# Altium schematic sheet PowerPC_AMCC_PPC405CR_Flash_Recorder.SchDoc
size C; DocumentNumber: 1; SheetNumber: 1; SheetTotal: 1; PageSetup: Record=PageOptions|CenterHorizontal=True|CenterVertical=True|PrintScale=0.75|XCorrection=1.00|YCorrection=1.00|PrintKind=0|BorderSize=5000000|LeftOffset=0|BottomOffset=0|Orientation=2|PaperLength=1000|PaperWidth=1000|Scale=100|PaperSource=7|PrintQuality=-4|MediaType=1|DitherType=10|PaperKind=A4|PrintScaleMode=1
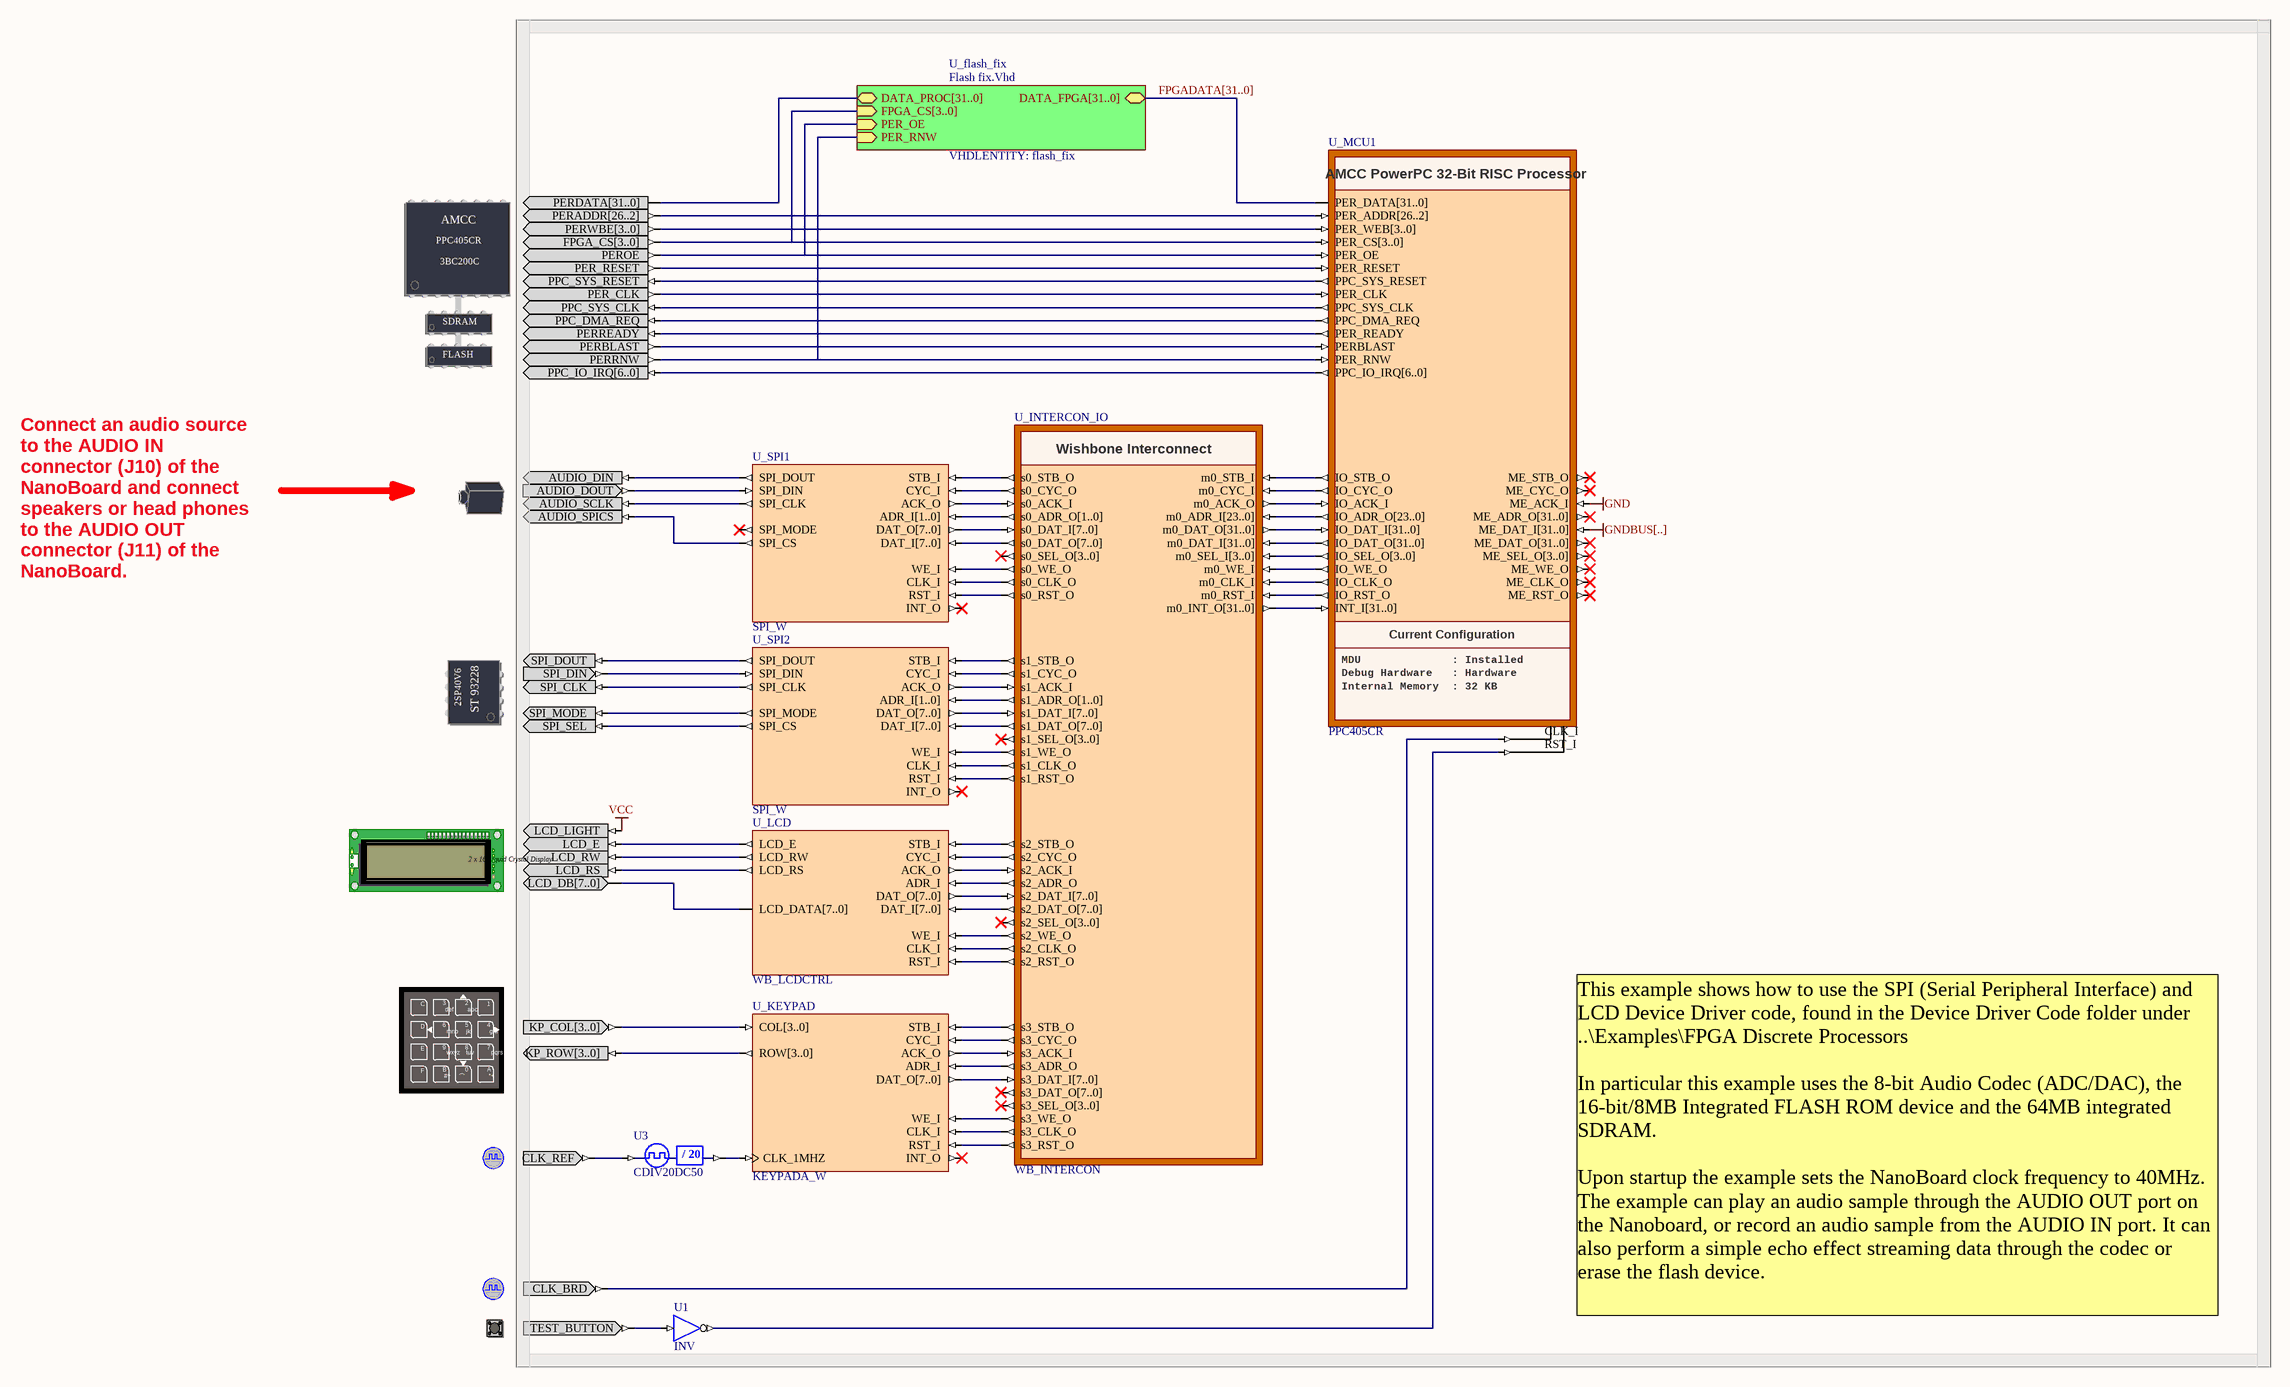
[diagram p0: PowerPC_AMCC_PPC405CR_Flash_Recorder.SchDoc]

## Parts
(Parts that share a designator on the sheet are numbered #1, #2 ... from top to bottom, then left to right.)
?#1  PROCESSOR_PPC405CR  (value not drawn)
?#2  AUDIO_DAC  (value not drawn)
?#3  SERIALFMEMORY  (value not drawn)
?#4  LCD  (value not drawn)
?#5  KEYPAD  (value not drawn)
?#6  CLOCK_REFERENCE  (value not drawn)
?#7  CLOCK_BOARD  (value not drawn)
?#8  TEST_BUTTON  (value not drawn)
U1  INV
U3  CDIV20DC50
U_INTERCON_IO  WB_INTERCON
U_KEYPAD  KEYPADA_W
U_LCD  WB_LCDCTRL
U_MCU1  PPC405CR
U_SPI1  SPI_W
U_SPI2  SPI_W

## Sub-sheets
U_flash_fix = Flash fix.Vhd: DATA_FPGA[31..0] (bidir), DATA_PROC[31..0] (bidir), FPGA_CS[3..0] (in), PER_OE (in), PER_RNW (in)  | VHDLENTITY: flash_fix

## Nets
GND: U_MCU1.ME_ACK_I
GNDBUS[..]: U_MCU1.ME_DAT_I[31..0]
VCC: ?#4.LCD_LIGHT
FPGADATA[31..0]: U_MCU1.PER_DATA[31..0] ; sheet U_flash_fix/DATA_FPGA[31..0]
Net?#1_FPGA_CS[3..0]: ?#1.FPGA_CS[3..0] U_MCU1.PER_CS[3..0] ; sheet U_flash_fix/FPGA_CS[3..0]
Net?#1_PER_CLK: ?#1.PER_CLK U_MCU1.PER_CLK
Net?#1_PER_RESET: ?#1.PER_RESET U_MCU1.PER_RESET
Net?#1_PERADDR[26..2]: ?#1.PERADDR[26..2] U_MCU1.PER_ADDR[26..2]
Net?#1_PERBLAST: ?#1.PERBLAST U_MCU1.PERBLAST
Net?#1_PERDATA[31..0]: ?#1.PERDATA[31..0] ; sheet U_flash_fix/DATA_PROC[31..0]
Net?#1_PEROE: ?#1.PEROE U_MCU1.PER_OE ; sheet U_flash_fix/PER_OE
Net?#1_PERREADY: ?#1.PERREADY U_MCU1.PER_READY
Net?#1_PERRNW: ?#1.PERRNW U_MCU1.PER_RNW ; sheet U_flash_fix/PER_RNW
Net?#1_PERWBE[3..0]: ?#1.PERWBE[3..0] U_MCU1.PER_WEB[3..0]
Net?#1_PPC_DMA_REQ: ?#1.PPC_DMA_REQ U_MCU1.PPC_DMA_REQ
Net?#1_PPC_IO_IRQ[6..0]: ?#1.PPC_IO_IRQ[6..0] U_MCU1.PPC_IO_IRQ[6..0]
Net?#1_PPC_SYS_CLK: ?#1.PPC_SYS_CLK U_MCU1.PPC_SYS_CLK
Net?#1_PPC_SYS_RESET: ?#1.PPC_SYS_RESET U_MCU1.PPC_SYS_RESET
Net?#2_AUDIO_DIN: ?#2.AUDIO_DIN U_SPI1.SPI_DOUT
Net?#2_AUDIO_DOUT: ?#2.AUDIO_DOUT U_SPI1.SPI_DIN
Net?#2_AUDIO_SCLK: ?#2.AUDIO_SCLK U_SPI1.SPI_CLK
Net?#2_AUDIO_SPICS: ?#2.AUDIO_SPICS U_SPI1.SPI_CS
Net?#3_SPI_CLK: ?#3.SPI_CLK U_SPI2.SPI_CLK
Net?#3_SPI_DIN: ?#3.SPI_DIN U_SPI2.SPI_DIN
Net?#3_SPI_DOUT: ?#3.SPI_DOUT U_SPI2.SPI_DOUT
Net?#3_SPI_MODE: ?#3.SPI_MODE U_SPI2.SPI_MODE
Net?#3_SPI_SEL: ?#3.SPI_SEL U_SPI2.SPI_CS
Net?#4_LCD_DB[7..0]: ?#4.LCD_DB[7..0] U_LCD.LCD_DATA[7..0]
Net?#4_LCD_E: ?#4.LCD_E U_LCD.LCD_E
Net?#4_LCD_RS: ?#4.LCD_RS U_LCD.LCD_RS
Net?#4_LCD_RW: ?#4.LCD_RW U_LCD.LCD_RW
Net?#5_KP_COL[3..0]: ?#5.KP_COL[3..0] U_KEYPAD.COL[3..0]
Net?#5_KP_ROW[3..0]: ?#5.KP_ROW[3..0] U_KEYPAD.ROW[3..0]
Net?#6_CLK_REF: ?#6.CLK_REF U3.CLKIN
Net?#7_CLK_BRD: ?#7.CLK_BRD U_MCU1.CLK_I
Net?#8_TEST_BUTTON: ?#8.TEST_BUTTON U1.I
NetU1_O: U1.O U_MCU1.RST_I
NetU3_CLKDV: U3.CLKDV U_KEYPAD.CLK_1MHZ
NetU_INTERCON_IO_m0_ACK_O: U_INTERCON_IO.m0_ACK_O U_MCU1.IO_ACK_I
NetU_INTERCON_IO_m0_ADR_I[23..0]: U_INTERCON_IO.m0_ADR_I[23..0] U_MCU1.IO_ADR_O[23..0]
NetU_INTERCON_IO_m0_CLK_I: U_INTERCON_IO.m0_CLK_I U_MCU1.IO_CLK_O
NetU_INTERCON_IO_m0_CYC_I: U_INTERCON_IO.m0_CYC_I U_MCU1.IO_CYC_O
NetU_INTERCON_IO_m0_DAT_I[31..0]: U_INTERCON_IO.m0_DAT_I[31..0] U_MCU1.IO_DAT_O[31..0]
NetU_INTERCON_IO_m0_DAT_O[31..0]: U_INTERCON_IO.m0_DAT_O[31..0] U_MCU1.IO_DAT_I[31..0]
NetU_INTERCON_IO_m0_INT_O[31..0]: U_INTERCON_IO.m0_INT_O[31..0] U_MCU1.INT_I[31..0]
NetU_INTERCON_IO_m0_RST_I: U_INTERCON_IO.m0_RST_I U_MCU1.IO_RST_O
NetU_INTERCON_IO_m0_SEL_I[3..0]: U_INTERCON_IO.m0_SEL_I[3..0] U_MCU1.IO_SEL_O[3..0]
NetU_INTERCON_IO_m0_STB_I: U_INTERCON_IO.m0_STB_I U_MCU1.IO_STB_O
NetU_INTERCON_IO_m0_WE_I: U_INTERCON_IO.m0_WE_I U_MCU1.IO_WE_O
NetU_INTERCON_IO_s0_ACK_I: U_INTERCON_IO.s0_ACK_I U_SPI1.ACK_O
NetU_INTERCON_IO_s0_ADR_O[1..0]: U_INTERCON_IO.s0_ADR_O[1..0] U_SPI1.ADR_I[1..0]
NetU_INTERCON_IO_s0_CLK_O: U_INTERCON_IO.s0_CLK_O U_SPI1.CLK_I
NetU_INTERCON_IO_s0_CYC_O: U_INTERCON_IO.s0_CYC_O U_SPI1.CYC_I
NetU_INTERCON_IO_s0_DAT_I[7..0]: U_INTERCON_IO.s0_DAT_I[7..0] U_SPI1.DAT_O[7..0]
NetU_INTERCON_IO_s0_DAT_O[7..0]: U_INTERCON_IO.s0_DAT_O[7..0] U_SPI1.DAT_I[7..0]
NetU_INTERCON_IO_s0_RST_O: U_INTERCON_IO.s0_RST_O U_SPI1.RST_I
NetU_INTERCON_IO_s0_STB_O: U_INTERCON_IO.s0_STB_O U_SPI1.STB_I
NetU_INTERCON_IO_s0_WE_O: U_INTERCON_IO.s0_WE_O U_SPI1.WE_I
NetU_INTERCON_IO_s1_ACK_I: U_INTERCON_IO.s1_ACK_I U_SPI2.ACK_O
NetU_INTERCON_IO_s1_ADR_O[1..0]: U_INTERCON_IO.s1_ADR_O[1..0] U_SPI2.ADR_I[1..0]
NetU_INTERCON_IO_s1_CLK_O: U_INTERCON_IO.s1_CLK_O U_SPI2.CLK_I
NetU_INTERCON_IO_s1_CYC_O: U_INTERCON_IO.s1_CYC_O U_SPI2.CYC_I
NetU_INTERCON_IO_s1_DAT_I[7..0]: U_INTERCON_IO.s1_DAT_I[7..0] U_SPI2.DAT_O[7..0]
NetU_INTERCON_IO_s1_DAT_O[7..0]: U_INTERCON_IO.s1_DAT_O[7..0] U_SPI2.DAT_I[7..0]
NetU_INTERCON_IO_s1_RST_O: U_INTERCON_IO.s1_RST_O U_SPI2.RST_I
NetU_INTERCON_IO_s1_STB_O: U_INTERCON_IO.s1_STB_O U_SPI2.STB_I
NetU_INTERCON_IO_s1_WE_O: U_INTERCON_IO.s1_WE_O U_SPI2.WE_I
NetU_INTERCON_IO_s2_ACK_I: U_INTERCON_IO.s2_ACK_I U_LCD.ACK_O
NetU_INTERCON_IO_s2_ADR_O: U_INTERCON_IO.s2_ADR_O U_LCD.ADR_I
NetU_INTERCON_IO_s2_CLK_O: U_INTERCON_IO.s2_CLK_O U_LCD.CLK_I
NetU_INTERCON_IO_s2_CYC_O: U_INTERCON_IO.s2_CYC_O U_LCD.CYC_I
NetU_INTERCON_IO_s2_DAT_I[7..0]: U_INTERCON_IO.s2_DAT_I[7..0] U_LCD.DAT_O[7..0]
NetU_INTERCON_IO_s2_DAT_O[7..0]: U_INTERCON_IO.s2_DAT_O[7..0] U_LCD.DAT_I[7..0]
NetU_INTERCON_IO_s2_RST_O: U_INTERCON_IO.s2_RST_O U_LCD.RST_I
NetU_INTERCON_IO_s2_STB_O: U_INTERCON_IO.s2_STB_O U_LCD.STB_I
NetU_INTERCON_IO_s2_WE_O: U_INTERCON_IO.s2_WE_O U_LCD.WE_I
NetU_INTERCON_IO_s3_ACK_I: U_INTERCON_IO.s3_ACK_I U_KEYPAD.ACK_O
NetU_INTERCON_IO_s3_ADR_O: U_INTERCON_IO.s3_ADR_O U_KEYPAD.ADR_I
NetU_INTERCON_IO_s3_CLK_O: U_INTERCON_IO.s3_CLK_O U_KEYPAD.CLK_I
NetU_INTERCON_IO_s3_CYC_O: U_INTERCON_IO.s3_CYC_O U_KEYPAD.CYC_I
NetU_INTERCON_IO_s3_DAT_I[7..0]: U_INTERCON_IO.s3_DAT_I[7..0] U_KEYPAD.DAT_O[7..0]
NetU_INTERCON_IO_s3_RST_O: U_INTERCON_IO.s3_RST_O U_KEYPAD.RST_I
NetU_INTERCON_IO_s3_STB_O: U_INTERCON_IO.s3_STB_O U_KEYPAD.STB_I
NetU_INTERCON_IO_s3_WE_O: U_INTERCON_IO.s3_WE_O U_KEYPAD.WE_I

Not connected (* = marked no-connect by the designer): U_INTERCON_IO s0_SEL_O[3..0]* s1_SEL_O[3..0]* s2_SEL_O[3..0]* s3_DAT_O[7..0]* s3_SEL_O[3..0]*; U_KEYPAD INT_O*; U_MCU1 ME_ADR_O[31..0]* ME_CLK_O* ME_CYC_O* ME_DAT_O[31..0]* ME_RST_O* ME_SEL_O[3..0]* ME_STB_O* ME_WE_O*; U_SPI1 INT_O* SPI_MODE*; U_SPI2 INT_O*

## Buses and harness runs
bus FPGADATA[31..0] = sheet U_flash_fix/DATA_FPGA[31..0]

## Notes on the sheet
- Connect an audio source to the AUDIO IN connector (J10) of the NanoBoard and connect speakers or head phones to the AUDIO OUT connector (J11) of the NanoBoard.
- This example shows how to use the SPI (Serial Peripheral Interface) and LCD Device Driver code, found in the Device Driver Code folder under ..\Examples\FPGA Discrete Processors
  In particular this example uses the 8-bit Audio Codec (ADC/DAC), the 16-bit/8MB Integrated FLASH ROM device and the 64MB integrated SDRAM.
  Upon startup the example sets the NanoBoard clock frequency to 40MHz. The example can play an audio sample through the AUDIO OUT port on the Nanoboard, or record an audio sample from the AUDIO IN port. It can also perform a simple echo effect streaming data through the codec or erase the flash device.
- Title
- Size:
- Date:
- File:
- C
- Number:
- Time:
- Revision:
- Sheet
- of
- (in symbol CDIV20DC50) / 20
- (in symbol KEYPAD) C; 3; 2; 1; def; abc; 6; 5; 4; D; mno; jkl; ghi; E; 9; 8; 7; wxyz; tuv; pqrs; F; B; 0; A; #^; (; *+
- (in symbol LCD) 2 x 16 Liquid Crystal Display
- (in symbol PPC405CR) AMCC PowerPC 32-Bit RISC Processor; Current Configuration; MDU              : Installed; Debug Hardware   : Hardware; Internal Memory  : 32 KB
- (in symbol PROCESSOR_PPC405CR) AMCC; PPC405CR; 3BC200C; SDRAM; FLASH
- (in symbol SERIALFMEMORY) 2SP40V6; ST 93228
- (in symbol WB_INTERCON) Wishbone Interconnect

## Library data of the parts
?#1 = PROCESSOR_PPC405CR: AMCC PowerPC 405CR Embedded Processor; PortComponent: True; Published: 25-Aug-2005; Publisher: Altium Limited; HelpURL: https://www.amcc.com/MyAMCC/jsp/public/productDetail/product_detail.jsp?productID=PPC405CR
?#2 = AUDIO_DAC: Audio Jack; PortComponent: True; Published: 19-Nov-2003; Publisher: Altium Limited; HelpURL: TR0102 NanoBoard Technical Reference Manual - NB1.pdf#page=38
?#3 = SERIALFMEMORY: Serial Flash Memory; PortComponent: True; Published: 19-Nov-2003; Publisher: Altium Limited; HelpURL: TR0102 NanoBoard Technical Reference Manual - NB1.pdf#page=34
?#4 = LCD: Liquid Crystal Display; PortComponent: True; Published: 19-Nov-2003; Publisher: Altium Limited; HelpURL: TR0102 NanoBoard Technical Reference Manual - NB1.pdf#page=39
?#5 = KEYPAD: Key Pad; PortComponent: True; Published: 19-Nov-2003; Publisher: Altium Limited; HelpURL: TR0102 NanoBoard Technical Reference Manual - NB1.pdf#page=40
?#6 = CLOCK_REFERENCE: Global System Clock Reference Supply; PortComponent: True; Published: 19-Nov-2003; Publisher: Altium Limited; HelpURL: TR0102 NanoBoard Technical Reference Manual - NB1.pdf#page=29
?#7 = CLOCK_BOARD: Global System Clock Supply; PortComponent: True; Published: 19-Nov-2003; Publisher: Altium Limited
?#8 = TEST_BUTTON: Test Button; PortComponent: True; Published: 19-Nov-2003; Publisher: Altium Limited
U1 = INV: Inverter; ArchiveName: GENERIC; FunctionalClass: Logic Primitive; VHDLIB_SIM: GENERIC_LIB; Published: 29-Jan-2004; Publisher: Altium Limited; XilinxEquivalent: INV; LastRevisionNo: 1.00.00; HelpURL: CR0118 FPGA Generic Library Guide.pdf#page=290; ComponentLink1URL: CR0136 FPGA Logic Primitive Resource Usage.pdf#page=61; ComponentLink1Description: Core &Resource Usage; SubClass: INV
U3 = CDIV20DC50: Clock Divider by 20 with 50% Duty Cycle Output; DivisorRate: 20; DutyCycle: 50; ArchiveName: GENERIC; VHDLIB_SIM: GENERIC_LIB; Published: 29-Jan-2004; Publisher: Altium Limited; LastRevisionNo: 1.00.00; HelpURL: CR0118 FPGA Generic Library Guide.pdf#page=142; ComponentLink1URL: CR0127 FPGA Clock Divider Resource Usage.pdf#page=21; ComponentLink1Description: Core &Resource Usage; FunctionalClass: Clock Divider
U_INTERCON_IO = WB_INTERCON: Configurable Wishbone Interconnect; ConfigurationParameters: {}UnusedInterrupts[1]{}MasterAddressBits[1]{}Name0[MAX1104]{}Kind0[0]{}SpaceAfter0[4]{}Address_Base0[0]{}Address_UsedRange0[1]{}Address_Bits0[2]{}Address_Mode0[1]{}Address_DecodeWidth0[4]{}DataWidth0[2]{}UsedInterrupts0[]{}Name1[NanoBoard_SPI]{}Kind1[0]{}SpaceAfter1[4]{}Address_Base1[1048576]{}Address_UsedRange1[1]{}Address_Bits1[2]{}Address_Mode1[0]{}Address_DecodeWidth1[4]{}DataWidth1[2]{}UsedInterrupts1[]{}Name2[LCD]{}Kind2[0]{}SpaceAfter2[4]{}Address_Base2[2097152]{}Address_UsedRange2[1]{}Address_Bits2[1]{}Address_Mode2[1]{}Address_DecodeWidth2[8]{}DataWidth2[2]{}UsedInterrupts2[]{}Name3[Keypad]{}Kind3[0]{}SpaceAfter3[4]{}Address_Base3[3145728]{}Address_UsedRange3[1]{}Address_Bits3[1]{}Address_Mode3[1]{}Address_DecodeWidth3[8]{}DataWidth3[2]{}UsedInterrupts3[]; ComponentLink1Description: Core &Resource Usage; ComponentLink1URL: CR0139 FPGA Peripheral Resource Usage.pdf#page=51; HelpURL: CR0150 WB_INTERCON Configurable Wishbone Interconnect.pdf#page=2; LastRevisionNo: 1.00.00; Published: 9-Dec-2004; Publisher: Altium Limited; ConfiguratorName: WB_INTERCON
U_KEYPAD = KEYPADA_W: Keypad Wishbone; Published: 9-Dec-2004; Publisher: Altium Limited; LastRevisionNo: 1.00.00; HelpURL: CR0106 Keypad Controller.pdf#page=2; ComponentLink1Description: Core &Resource Usage; ComponentLink1URL: CR0139 FPGA Peripheral Resource Usage.pdf#page=15
U_LCD = WB_LCDCTRL: LCD Controller Wishbone; ArchiveName: GENERIC; Published: 9-Dec-2004; Publisher: Altium Limited; ComponentLink1Description: Core &Resource Usage; ComponentLink1URL: CR0139 FPGA Peripheral Resource Usage.pdf#page=56; LastRevisionNo: 1.00.00
U_MCU1 = PPC405CR: AMCC PowerPC PPC405 RISC Processor; ChildModel1: TSK3000A_MCU; Nexus_JTAG_Device: False; Nexus_Core: Processor_Hard; Nexus_JTAG_Order: 0; ChildModel2: TSK3000A_MDU; ChildModel3: TSK3000A_OCDS; ChildModel4: TSK3000A_Shift_Barrel; ChildModel5: TSK3000A_Shift_Sequential; ChildModel6: Mult_32x32; ConfigurationParameters: {}Version[1.0]{}Option_Processor[2]{}Option_Memory[5]{}Option_MDU[0]{}Option_OCDS[2]{}Option_Shifter[0]{}Option_InterruptCount[32]{}Option_DebugWhenReset[0]{}; ChildModel7: m33x33; Memory_Configuration: Record[PERIPHERAL]{}ComponentDesignator[MAX1104]{}Memory_Depth[0x0004]{}Memory_UsageType[ram]{}ProgramDownloadAddress[0xFF000000]{}Memory_BusType[PPC:local_bus]{}Memory_Mau[8]{}Memory_MatchedComponent[]{}Memory_Description[U_INTERCON_IO]{}Memory_FillBitPattern[]{}Memory_Interrupts[]{n}Record[PERIPHERAL]{}ComponentDesignator[NanoBoard_SPI]{}Memory_Depth[0x0004]{}Memory_UsageType[ram]{}ProgramDownloadAddress[0xFF100000]{}Memory_BusType[PPC:local_bus]{}Memory_Mau[8]{}Memory_MatchedComponent[]{}Memory_Description[U_INTERCON_IO]{}Memory_FillBitPattern[]{}Memory_Interrupts[]{n}Record[PERIPHERAL]{}ComponentDesignator[LCD]{}Memory_Depth[0x0002]{}Memory_UsageType[ram]{}ProgramDownloadAddress[0xFF200000]{}Memory_BusType[PPC:local_bus]{}Memory_Mau[8]{}Memory_MatchedComponent[]{}Memory_Description[U_INTERCON_IO]{}Memory_FillBitPattern[]{}Memory_Interrupts[]{n}Record[PERIPHERAL]{}ComponentDesignator[Keypad]{}Memory_Depth[0x0002]{}Memory_UsageType[ram]{}ProgramDownloadAddress[0xFF300000]{}Memory_BusType[PPC:local_bus]{}Memory_Mau[8]{}Memory_MatchedComponent[]{}Memory_Description[U_INTERCON_IO]{}Memory_FillBitPattern[]{}Memory_Interrupts[]{n}Record[CODE_EXPORT]{}ExportType[1]{n}Record[NEXUS_CORE]{}ComponentDesignator[Internal_ROM]{}Memory_Depth[16k]{}Memory_UsageType[rom]{}ProgramDownloadAddress[0x00000000]{}Memory_BusType[PPC:local_bus]{}Memory_Mau[8]{}Memory_MatchedComponent[]{}Memory_Description[]{}Memory_FillBitPattern[]{}Memory_Interrupts[]{n}Record[NEXUS_CORE]{}ComponentDesignator[SRAM_DB]{}Memory_Depth[0x100000]{}Memory_UsageType[nvram]{}ProgramDownloadAddress[0x01000000]{}Memory_BusType[PPC:local_bus]{}Memory_Mau[8]{}Memory_MatchedComponent[]{}Memory_Description[U_INTERCON_MEM]{}Memory_FillBitPattern[]{}Memory_Interrupts[]{n}Record[NEXUS_CORE]{}ComponentDesignator[Internal_RAM]{}Memory_Depth[16k]{}Memory_UsageType[ram]{}ProgramDownloadAddress[16k]{}Memory_BusType[PPC:local_bus]{}Memory_Mau[8]{}Memory_MatchedComponent[]{}Memory_Description[]{}Memory_FillBitPattern[]{}Memory_Interrupts[]{n}Record[NEXUS_CORE]{}ComponentDesignator[Daughter_Integrated_SDRAM]{}Memory_Depth[64M]{}Memory_UsageType[ram]{}ProgramDownloadAddress[0x80000000]{}Memory_BusType[PPC:local_bus]{}Memory_Mau[8]{}Memory_MatchedComponent[]{}Memory_Description[]{}Memory_FillBitPattern[]{}Memory_Interrupts[]{n}Record[NEXUS_CORE]{}ComponentDesignator[Daughter_Integrated_Flash]{}Memory_Depth[16M]{}Memory_UsageType[ram]{}ProgramDownloadAddress[0x70000000]{}Memory_BusType[PPC:local_bus]{}Memory_Mau[8]{}Memory_MatchedComponent[]{}Memory_Description[]{}Memory_FillBitPattern[]{}Memory_Interrupts[]{n}; ConfiguratorName: FPGA_MCU32; ProgramLogicalTopAddress: 0; ComponentLink1Description: Core &Resource Usage; ComponentLink1URL: CR0140 FPGA Processor Resource Usage.pdf#page=16; HelpURL: CR0121 TSK3000A 32 bit RISC Processor.pdf#page=6; LastRevisionNo: 1.00.00; Published: 17-Nov-2004; Publisher: Altium Limited
U_SPI1 = SPI_W: SPI Controller Wishbone; Published: 9-Dec-2004; Publisher: Altium Limited; ComponentLink1Description: Core &Resource Usage; ComponentLink1URL: CR0139 FPGA Peripheral Resource Usage.pdf#page=39; HelpURL: CR0153 SPI_W Serial Peripheral Interface Controller.pdf; LastRevisionNo: 1.05.01; LatestRevisionNote: Correction for the busy signal generation; LatestRevisionDate: 6-Sep-2005
U_SPI2 = SPI_W: SPI Controller Wishbone; ArchiveName: GENERIC; Published: 9-Dec-2004; Publisher: Altium Limited; ComponentLink1Description: Core &Resource Usage; ComponentLink1URL: CR0139 FPGA Peripheral Resource Usage.pdf#page=38; HelpURL: CR0153 SPI_W Serial Peripheral Interface Controller.pdf#page=2; LastRevisionNo: 1.00.00